# EAGLE design USBPower (EAGLE 8.2.2)
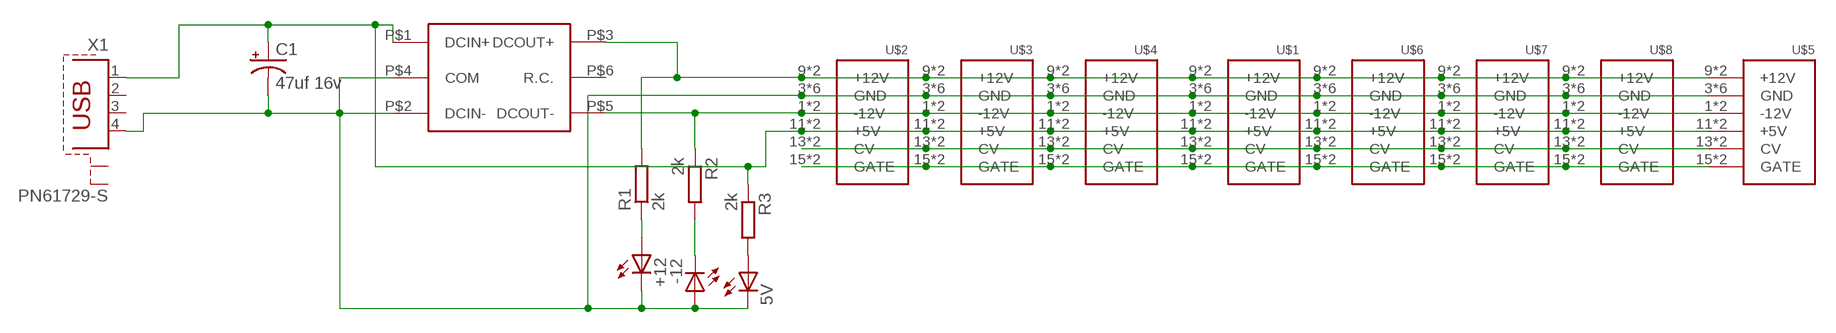
[diagram p0: schematic, sheet 1]

## Parts
5V  LED3MM  [LED3MM]
+12  LED3MM  [LED3MM]
-12  LED3MM  [LED3MM]
C1  47uf 16v  050  [050_020]
R1  2k  RESISTOR7MM  [7MM_RESISTOR]
R2  2k  RESISTOR7MM  [7MM_RESISTOR]
R3  2k  RESISTOR7MM  [7MM_RESISTOR]
U$1  POWER  [POWER_16]
U$2  POWER  [POWER_16]
U$3  POWER  [POWER_16]
U$4  POWER  [POWER_16]
U$5  POWER  [POWER_16]
U$6  POWER  [POWER_16]
U$7  POWER  [POWER_16]
U$8  POWER  [POWER_16]
U$9  DKM-10  [1X1]
X1  PN61729-S  [PN61729-S]

## Nets
5V [+12V]: C1.+ R3.1 U$1.11(+5V) U$1.12(+5V) U$2.11(+5V) U$2.12(+5V) U$3.11(+5V) U$3.12(+5V) U$4.11(+5V) U$4.12(+5V) U$5.11(+5V) U$5.12(+5V) U$6.11(+5V) U$6.12(+5V) U$7.11(+5V) U$7.12(+5V) U$8.11(+5V) U$8.12(+5V) U$9.P$1(DCIN+) X1.1
+12V [+12V]: R1.2 U$1.9(+12V) U$1.10(+12V) U$2.9(+12V) U$2.10(+12V) U$3.9(+12V) U$3.10(+12V) U$4.9(+12V) U$4.10(+12V) U$5.9(+12V) U$5.10(+12V) U$6.9(+12V) U$6.10(+12V) U$7.9(+12V) U$7.10(+12V) U$8.9(+12V) U$8.10(+12V) U$9.P$3(DCOUT+)
-12V [-12V]: R2.1 U$1.1(-12V) U$1.2(-12V) U$2.1(-12V) U$2.2(-12V) U$3.1(-12V) U$3.2(-12V) U$4.1(-12V) U$4.2(-12V) U$5.1(-12V) U$5.2(-12V) U$6.1(-12V) U$6.2(-12V) U$7.1(-12V) U$7.2(-12V) U$8.1(-12V) U$8.2(-12V) U$9.P$5(DCOUT-)
COM [COM]: 5V.K(C) +12.K(C) -12.A C1.- U$1.3(GND) U$1.4(GND) U$1.5(GND) U$1.6(GND) U$1.7(GND) U$1.8(GND) U$2.3(GND) U$2.4(GND) U$2.5(GND) U$2.6(GND) U$2.7(GND) U$2.8(GND) U$3.3(GND) U$3.4(GND) U$3.5(GND) U$3.6(GND) U$3.7(GND) U$3.8(GND) U$4.3(GND) U$4.4(GND) U$4.5(GND) U$4.6(GND) U$4.7(GND) U$4.8(GND) U$5.3(GND) U$5.4(GND) U$5.5(GND) U$5.6(GND) U$5.7(GND) U$5.8(GND) U$6.3(GND) U$6.4(GND) U$6.5(GND) U$6.6(GND) U$6.7(GND) U$6.8(GND) U$7.3(GND) U$7.4(GND) U$7.5(GND) U$7.6(GND) U$7.7(GND) U$7.8(GND) U$8.3(GND) U$8.4(GND) U$8.5(GND) U$8.6(GND) U$8.7(GND) U$8.8(GND) U$9.P$2(DCIN-) U$9.P$4(COM) X1.4
N$1: -12.K(C) R2.2
N$2: U$1.13(CV) U$1.14(CV) U$2.13(CV) U$2.14(CV) U$3.13(CV) U$3.14(CV) U$4.13(CV) U$4.14(CV) U$5.13(CV) U$5.14(CV) U$6.13(CV) U$6.14(CV) U$7.13(CV) U$7.14(CV) U$8.13(CV) U$8.14(CV)
N$3: U$1.15(GATE) U$1.16(GATE) U$2.15(GATE) U$2.16(GATE) U$3.15(GATE) U$3.16(GATE) U$4.15(GATE) U$4.16(GATE) U$5.15(GATE) U$5.16(GATE) U$6.15(GATE) U$6.16(GATE) U$7.15(GATE) U$7.16(GATE) U$8.15(GATE) U$8.16(GATE)
N$4: 5V.A R3.2
N$5: +12.A R1.1
Unconnected: U$9.P$6(R.C.) X1.2 X1.3 X1.S1 X1.S2

## Library data of the parts
5V +12 -12 = TomW:LED: LED OSRAM: - CHIPLED LG R971, LG N971, LY N971, LG Q971, LY Q971, LO R971, LY R971 LH N974, LH R974 LS Q976, LO Q976, LY Q976 LO Q996 - Hyper CHIPLED LW Q18S LB Q993, LB Q99A, LB R99A - SideLED LS A670, LO A670, LY A670, LG A670, LP A670 LB A673, LV A673, LT A673, LW A673 LH A674 LY A675 LS A676, LA A676, LO A676, LY A676, LW A676 LS A679, LY A679, LG A679 - Hyper Micro SIDELED® LS Y876, LA Y876, LO Y876, LY Y876 LT Y87S - SmartLED LW L88C, LW L88S LB L89C, LB L89S, LG L890 LS L89K, LO L89K, LY L89K LS L896, LA L896, LO L896, LY L896 - TOPLED LS T670, LO T670, LY T670, LG T670, LP T670 LSG T670, LSP T670, LSY T670, LOP T670, LYG T670 LG T671, LOG T671, LSG T671 LB T673, LV T673, LT T673, LW T673 LH T674 LS T676, LA T676, LO T676, LY T676, LB T676, LH T676, LSB T676, LW T676 LB T67C, LV T67C, LT T67C, LS T67K, LO T67K, LY T67K, LW E67C LS E67B, LA E67B, LO E67B, LY E67B, LB E67C, LV E67C, LT E67C LW T67C LS T679, LY T679, LG T679 LS T770, LO T770, LY T770, LG T770, LP T770 LB T773, LV T773, LT T773, LW T773 LH T774 LS E675, LA E675, LY E675, LS T675 LS T776, LA T776, LO T776, LY T776, LB T776 LHGB T686 LT T68C, LB T68C - Hyper Mini TOPLED® LB M676 - Mini TOPLED Santana® LG M470 LS M47K, LO M47K, LY M47K Source: http://www.osram.convergy.de LUXEON: - LUMILED® LXK2-PW12-R00, LXK2-PW12-S00, LXK2-PW14-U00, LXK2-PW14-V00 LXK2-PM12-R00, LXK2-PM12-S00, LXK2-PM14-U00 LXK2-PE12-Q00, LXK2-PE12-R00, LXK2-PE12-S00, LXK2-PE14-T00, LXK2-PE14-U00 LXK2-PB12-K00, LXK2-PB12-L00, LXK2-PB12-M00, LXK2-PB14-N00, LXK2-PB14-P00, LXK2-PB14-Q00 LXK2-PR12-L00, LXK2-PR12-M00, LXK2-PR14-Q00, LXK2-PR14-R00 LXK2-PD12-Q00, LXK2-PD12-R00, LXK2-PD12-S00 LXK2-PH12-R00, LXK2-PH12-S00 LXK2-PL12-P00, LXK2-PL12-Q00, LXK2-PL12-R00 Source: www.luxeon.com KINGBRIGHT: KA-3528ASYC Source: www.kingbright.com
C1 = gm-caps-electro-pol:050: 0.22 - 100uF Xicon values at Mouser.com: 10V: 10 - 100uF; 16V: 2.2 - 47uF; 25V: 0.47 - 47uF; 50V: 0.22 - 22uF
R1-R3 = MusicThingModular:RESISTOR: Standard resistor, various versions
U$1-U$8 = eurorack:POWER
U$9 = meanwell_dcdc:DKM-10
X1 = con-berg:PN61729-S: BERG USB connector; OC_FARNELL: unknown; OC_NEWARK: unknown

## Net classes
0 default: width 0.457 mm
1 +12V: width 0.61 mm
2 -12V: width 0.61 mm
3 COM: width 0.61 mm

## Board
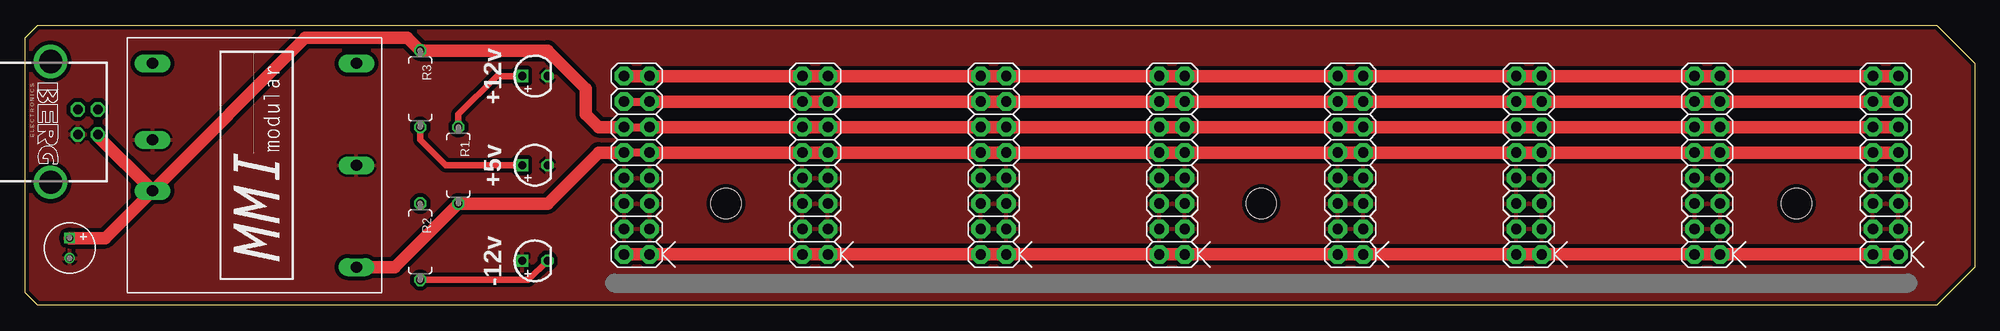
[diagram p1: board, top side]
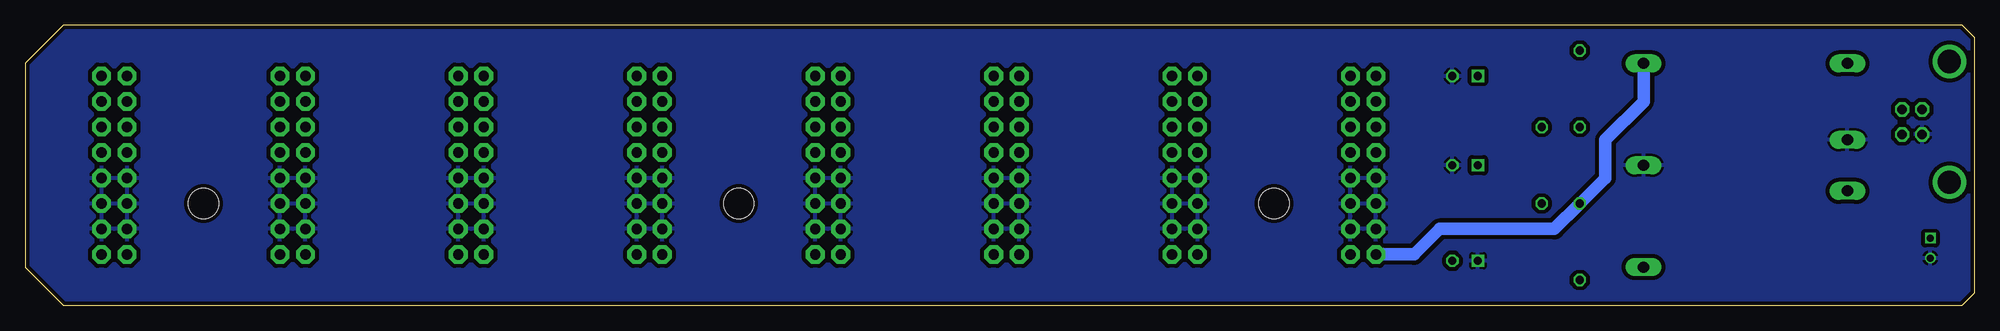
[diagram p2: board, bottom side, seen from below]

Size 194.31 x 27.94 mm. Coordinates in mm from the lower left corner, seen from the top.
Outline: 1.27,27.94 190.5,27.94 194.31,24.13 194.31,3.81 190.5,0 1.27,0 0,1.27 0,26.67 1.27,27.94
Copper layers (1*16): Top 0.0356mm / dielectric 1.5011mm / Bottom 0.0356mm
Design rules "oshpark-2layer": minimum track width 6mil, minimum drill 13mil, track to track 6mil, track to pad 6mil, pad to pad 6mil, via to via 6mil, smd to smd 6mil, copper to edge 15mil, drill to drill 6mil, minimum pad ring 7mil, minimum via ring 7mil, stop-mask expansion 2.5mil, vias tented up to drill 0mil, thermal gap 10mil
Holes 3 mm at 69.85,10.16 176.53,10.16 123.19,10.16

### Footprints (pad centres in the part's own frame; a part is rotated, then mirrored left to right if it is on the bottom)
LED3MM = drill 0.813 square: A -1.27,0 | drill 0.813 octagon: K 1.27,0
050_020 = drill 0.7 square: + -1,0 | drill 0.7: - 1,0
7MM_RESISTOR = drill 0.813 octagon: 1 -3.81,0; 2 3.81,0
POWER_16 = drill 1.016 pad 1.88 octagon: 1 -6.35,-1.27; 2 -6.35,1.27; 3 -3.81,-1.27; 4 -3.81,1.27; 5 -1.27,-1.27; 6 -1.27,1.27; 7 1.27,-1.27; 8 1.27,1.27; 9 3.81,-1.27; 10 3.81,1.27; 11 6.35,-1.27; 12 6.35,1.27; 13 8.89,-1.27; 14 8.89,1.27; 15 11.43,-1.27; 16 11.43,1.27
1X1 = drill 1.118 pad 1.778 long: P$1 2.54,-10.16; P$2 -2.54,-10.16; P$3 10.16,10.16; P$4 0,10.16; P$5 -10.16,10.16; P$6 -10.16,-10.16
PN61729-S = drill 0.95 octagon: 1 1.25,4.71; 2 -1.25,4.71; 3 -1.25,2.71; 4 1.25,2.71 | drill 2.3 pad 2.9: S1 -6.02,0; S2 6.02,0

### Placement (x,y rotation side)
5V  50.8,13.97 0 top
+12  50.8,22.86 0 top
-12  50.8,4.45 0 top
C1  4.45,5.71 270 top
R1  43.18,13.97 270 top
R2  39.37,6.35 270 top
R3  39.37,21.59 270 top
U$1  60.96,11.43 90 top
U$2  78.74,11.43 90 top
U$3  96.52,11.43 90 top
U$4  114.3,11.43 90 top
U$5  132.08,11.43 90 top
U$6  185.42,11.43 90 top
U$7  167.64,11.43 90 top
U$8  149.86,11.43 90 top
U$9  22.86,13.97 270 top
X1  2.54,18.29 270 top

### Tracks (layer width: path | path; a pad name or v marks a point on that pad's centre or on a via)
5V
  Top 0.813: U$1.12 U$1.11
  Top 1.27: U$1.11 U$2.12 U$2.11 U$3.12 U$3.11 U$4.12 U$4.11 U$5.12 U$5.11 U$8.12 U$8.11 U$7.12 U$7.11 U$6.12 U$6.11 | X1.1 7.25,16.88 U$9.P$1 | C1.+ 7.99,6.71 U$9.P$1 | U$9.P$1 27.94,26.67 38.1,26.67 R3.1 52.07,25.4 55.88,21.59 55.88,19.05 57.15,17.78 U$1.12
+12V
  Top 0.813: U$1.9 U$1.10
  Top 1.27: U$1.9 U$2.10 U$2.9 U$3.10 U$3.9 U$4.10 U$4.9 U$5.10 U$5.9 U$8.10 U$8.9 U$7.10 U$7.9 U$6.10 U$6.9 | U$9.P$3 36.83,3.81 R1.2 52.07,10.16 57.15,15.24 U$1.10
-12V
  Top 1.27: U$1.2 U$1.1 U$2.2 U$2.1 U$3.2 U$3.1 U$4.2 U$4.1 U$5.2 U$5.1 U$8.2 U$8.1 U$7.2 U$7.1 U$6.2 U$6.1
  Bottom 1.27: U$9.P$5 33.02,20.32 36.83,16.51 36.83,12.7 R2.1 41.91,7.62 53.34,7.62 55.88,5.08 U$1.2
COM
  pour Bottom (isolate 0.406): -1.27,29.21 199.39,29.21 199.39,-1.27 -1.27,-1.27
  pour Top (isolate 0.406): -1.27,29.21 199.39,29.21 199.39,-1.27 -1.27,-1.27
N$1
  Top 0.635: R2.2 50.16,2.54 -12.K
N$2
  Top 0.813: U$1.14 U$1.13
  Top 1.27: U$1.13 U$2.14 U$2.13 U$3.14 U$3.13 U$4.14 U$4.13 U$5.14 U$5.13 U$8.14 U$8.13 U$7.14 U$7.13 U$6.14 U$6.13
N$3
  Top 1.27: U$1.16 U$1.15 U$2.16 U$2.15 U$3.16 U$3.15 U$4.16 U$4.15 U$5.16 U$5.15 U$8.16 U$8.15 U$7.16 U$7.15 U$6.16 U$6.15
N$4
  Top 0.635: R3.2 39.37,16.51 41.91,13.97 5V.A
N$5
  Top 0.635: R1.1 43.18,19.05 46.99,22.86 +12.A

### Text on the board
tPlace: +12v | +5v | -12v
tDocu: But it's also dumb! | Well maybe it is stupid
bDocu: MMI Modular | CC-BY-SA: / Matt Gaines / Tom Whitwell | Rev 2.0 / 1/5/2018